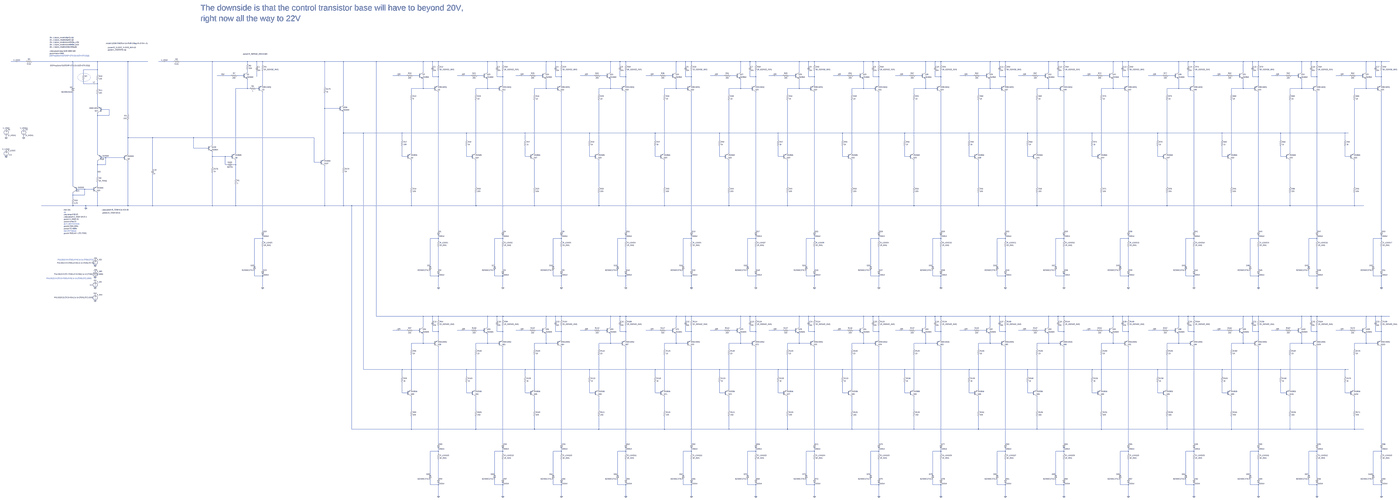
[diagram p0: schematic current_source_with_switch2.asc, whole sheet]
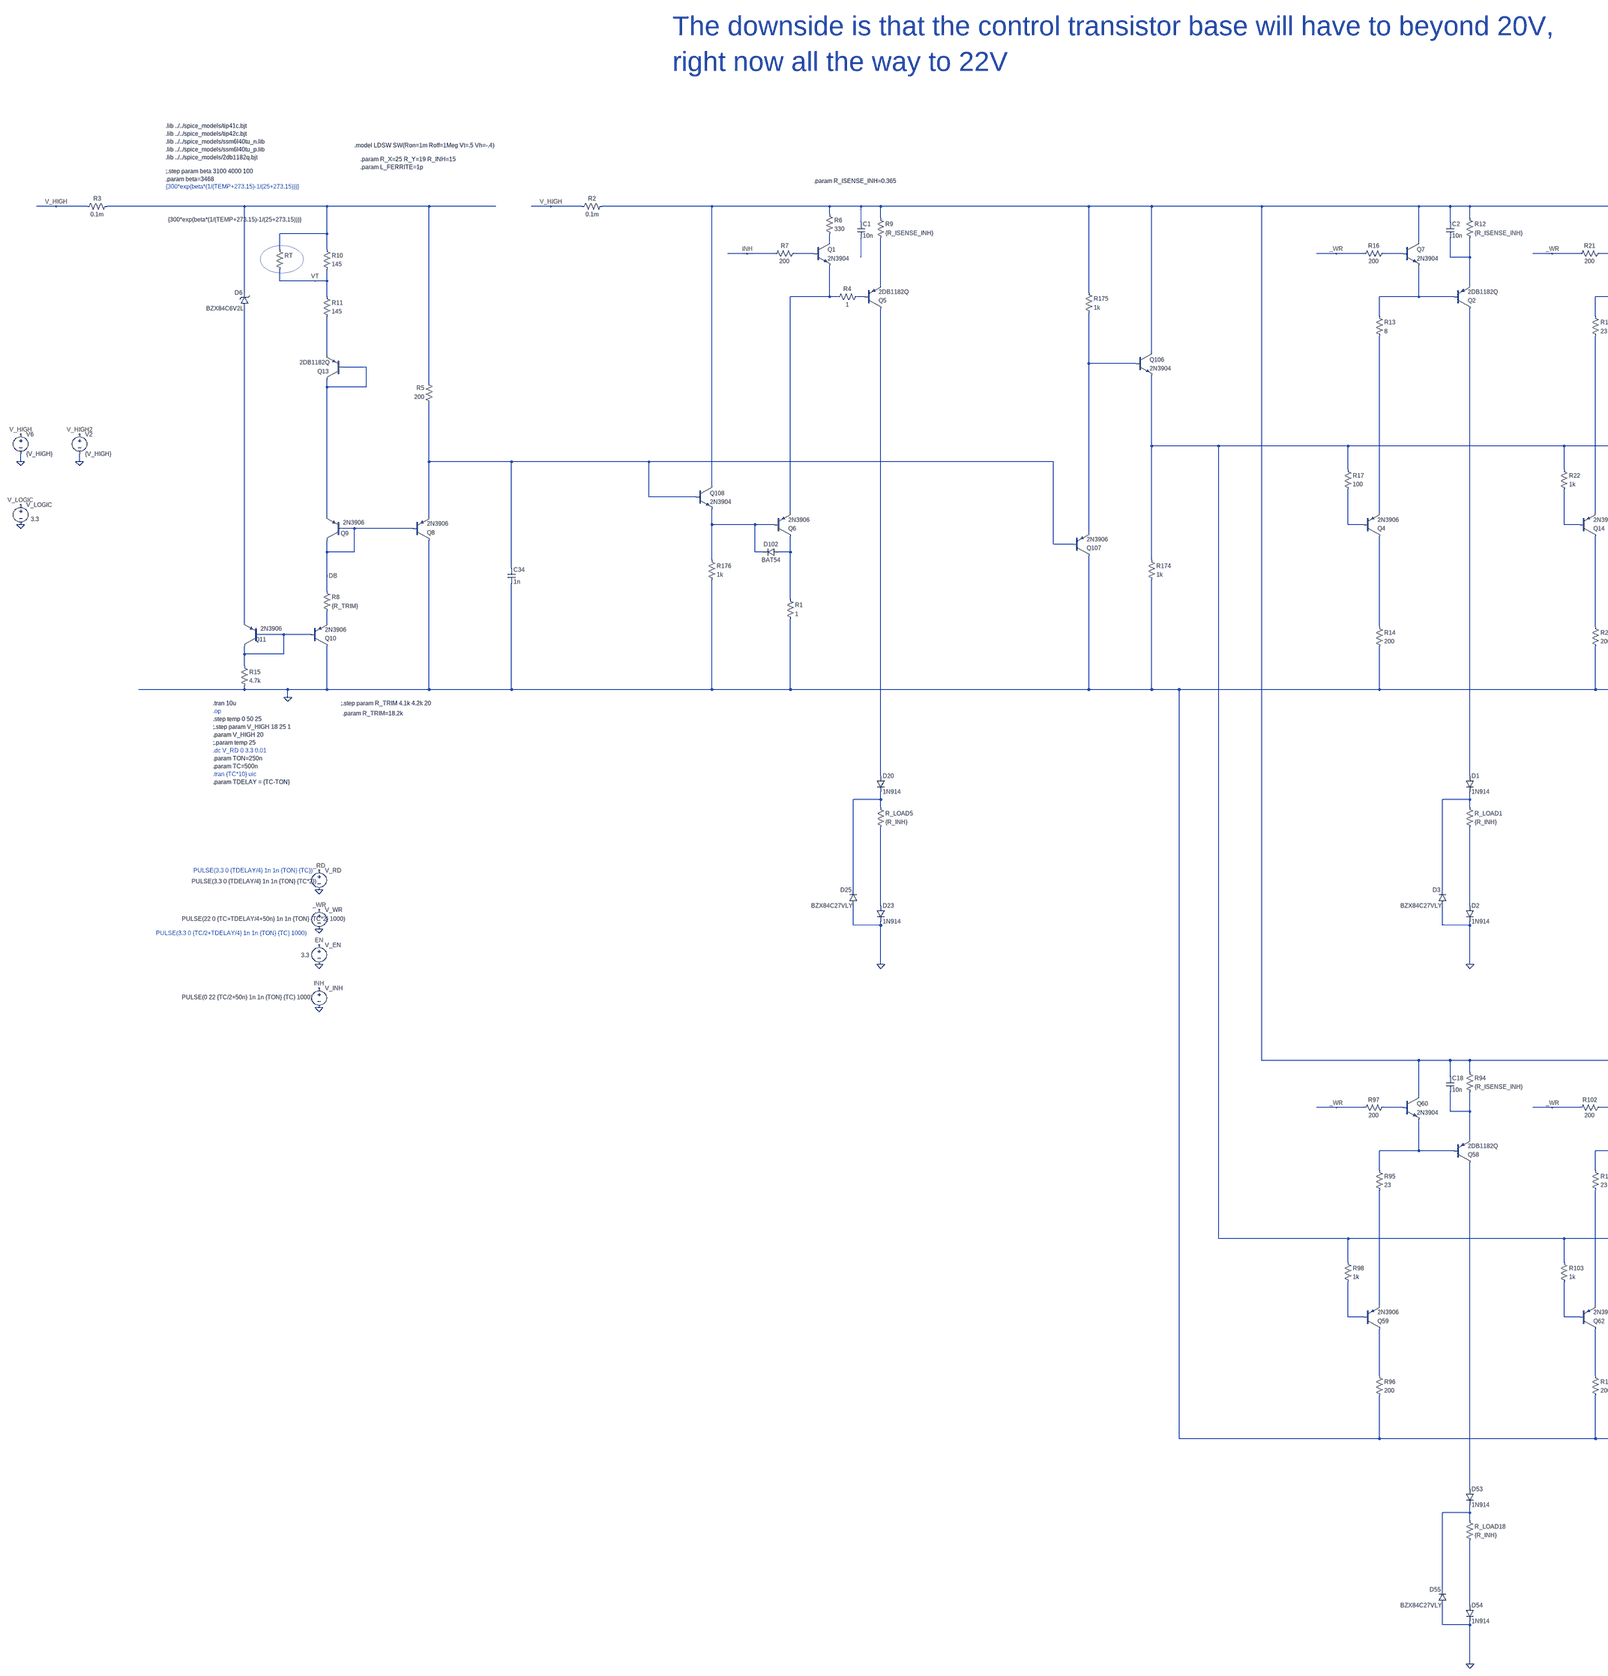
[diagram p1: schematic current_source_with_switch2.asc, part, row 1 of 1, column 1 of 3]
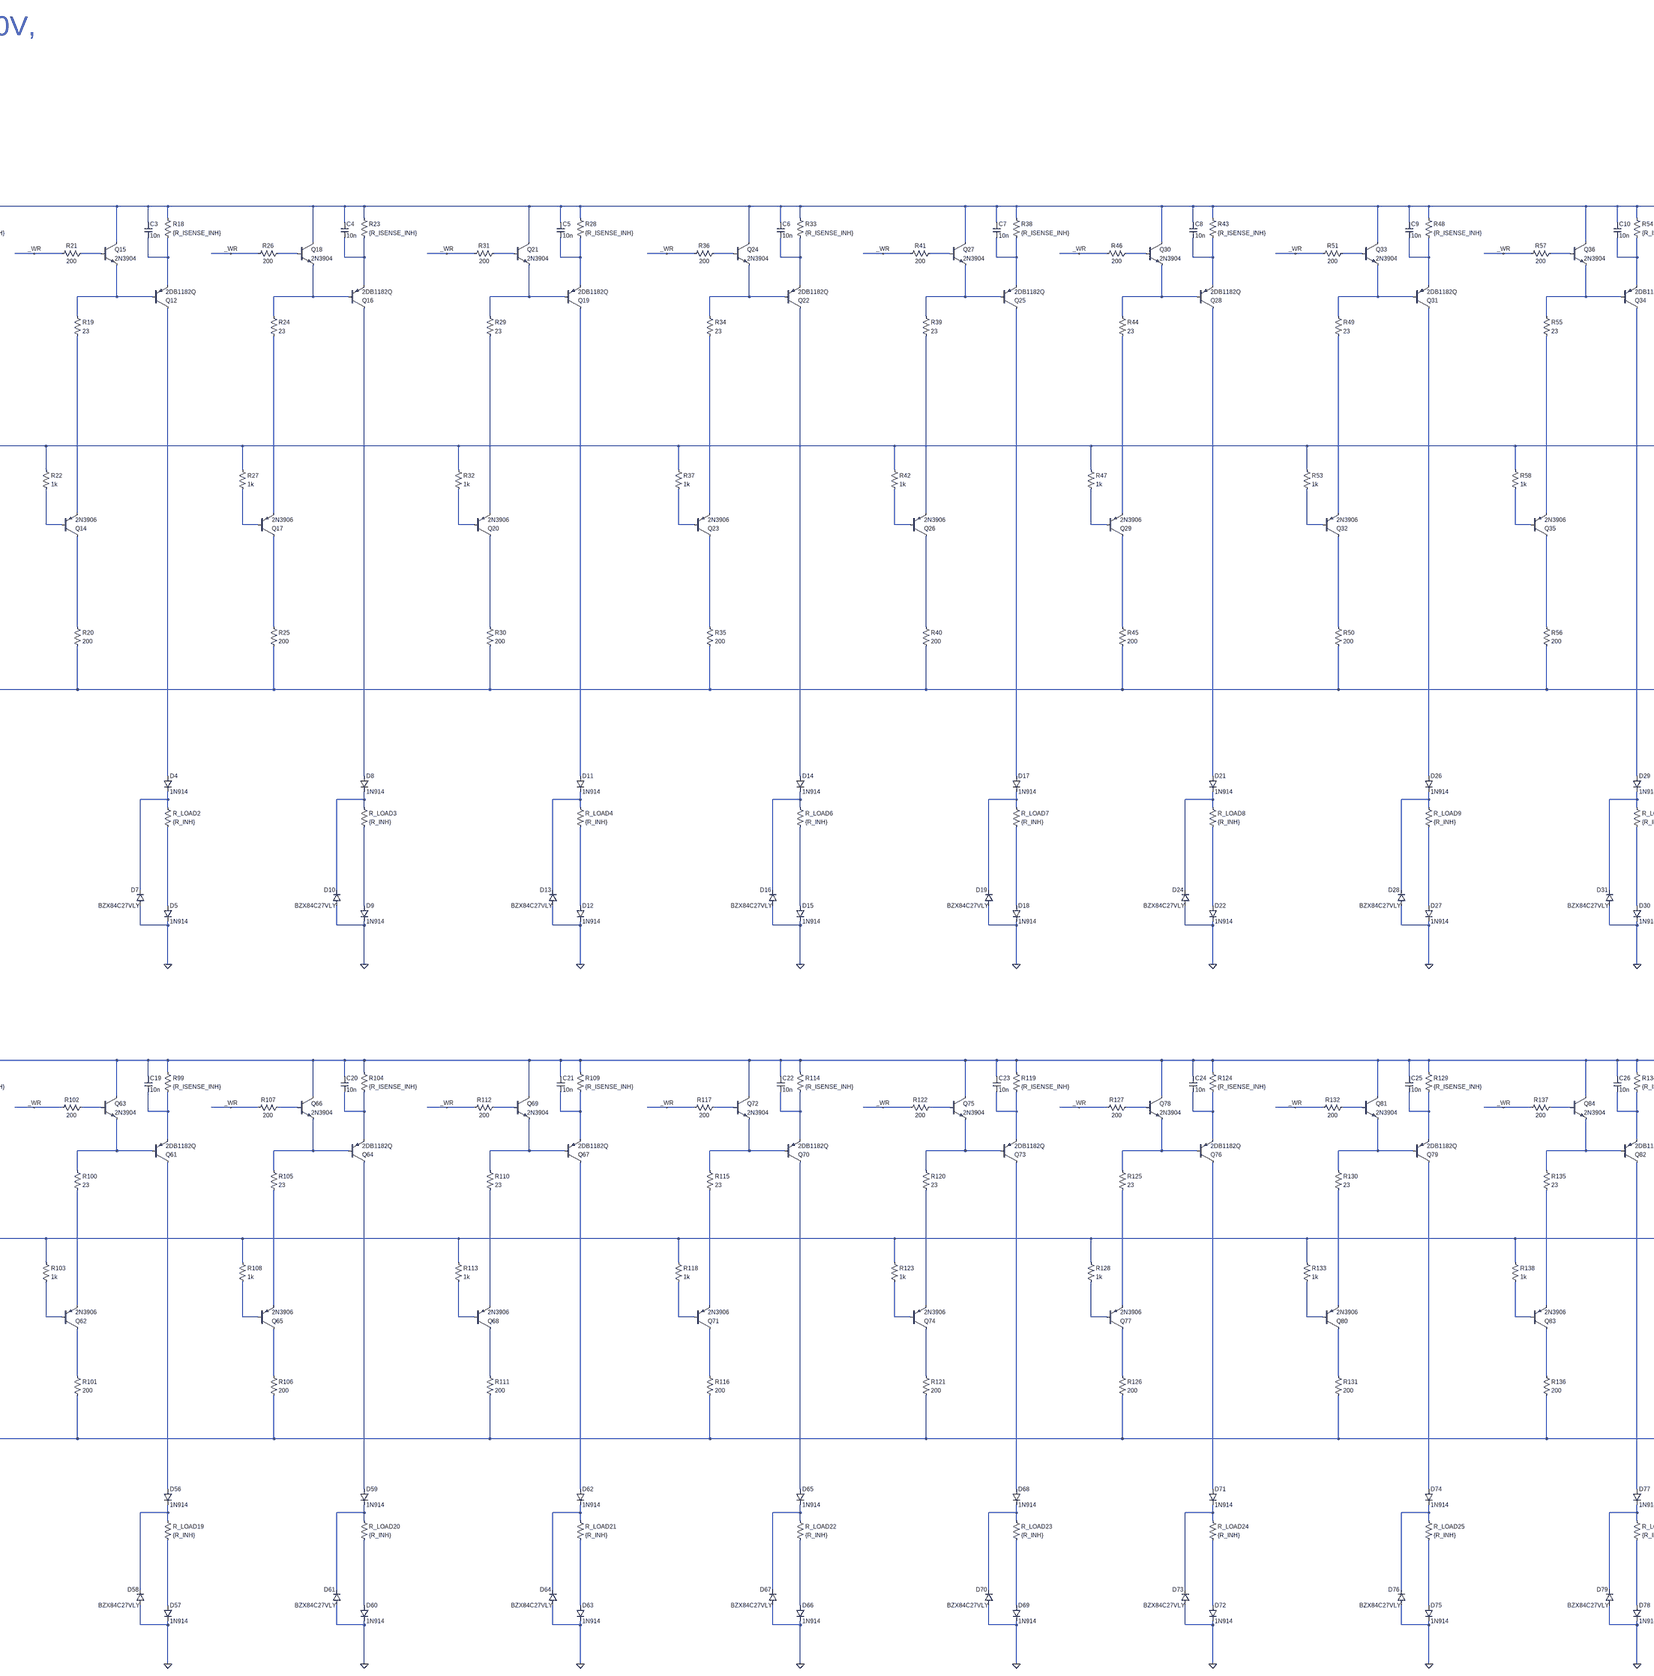
[diagram p2: schematic current_source_with_switch2.asc, part, row 1 of 1, column 2 of 3]
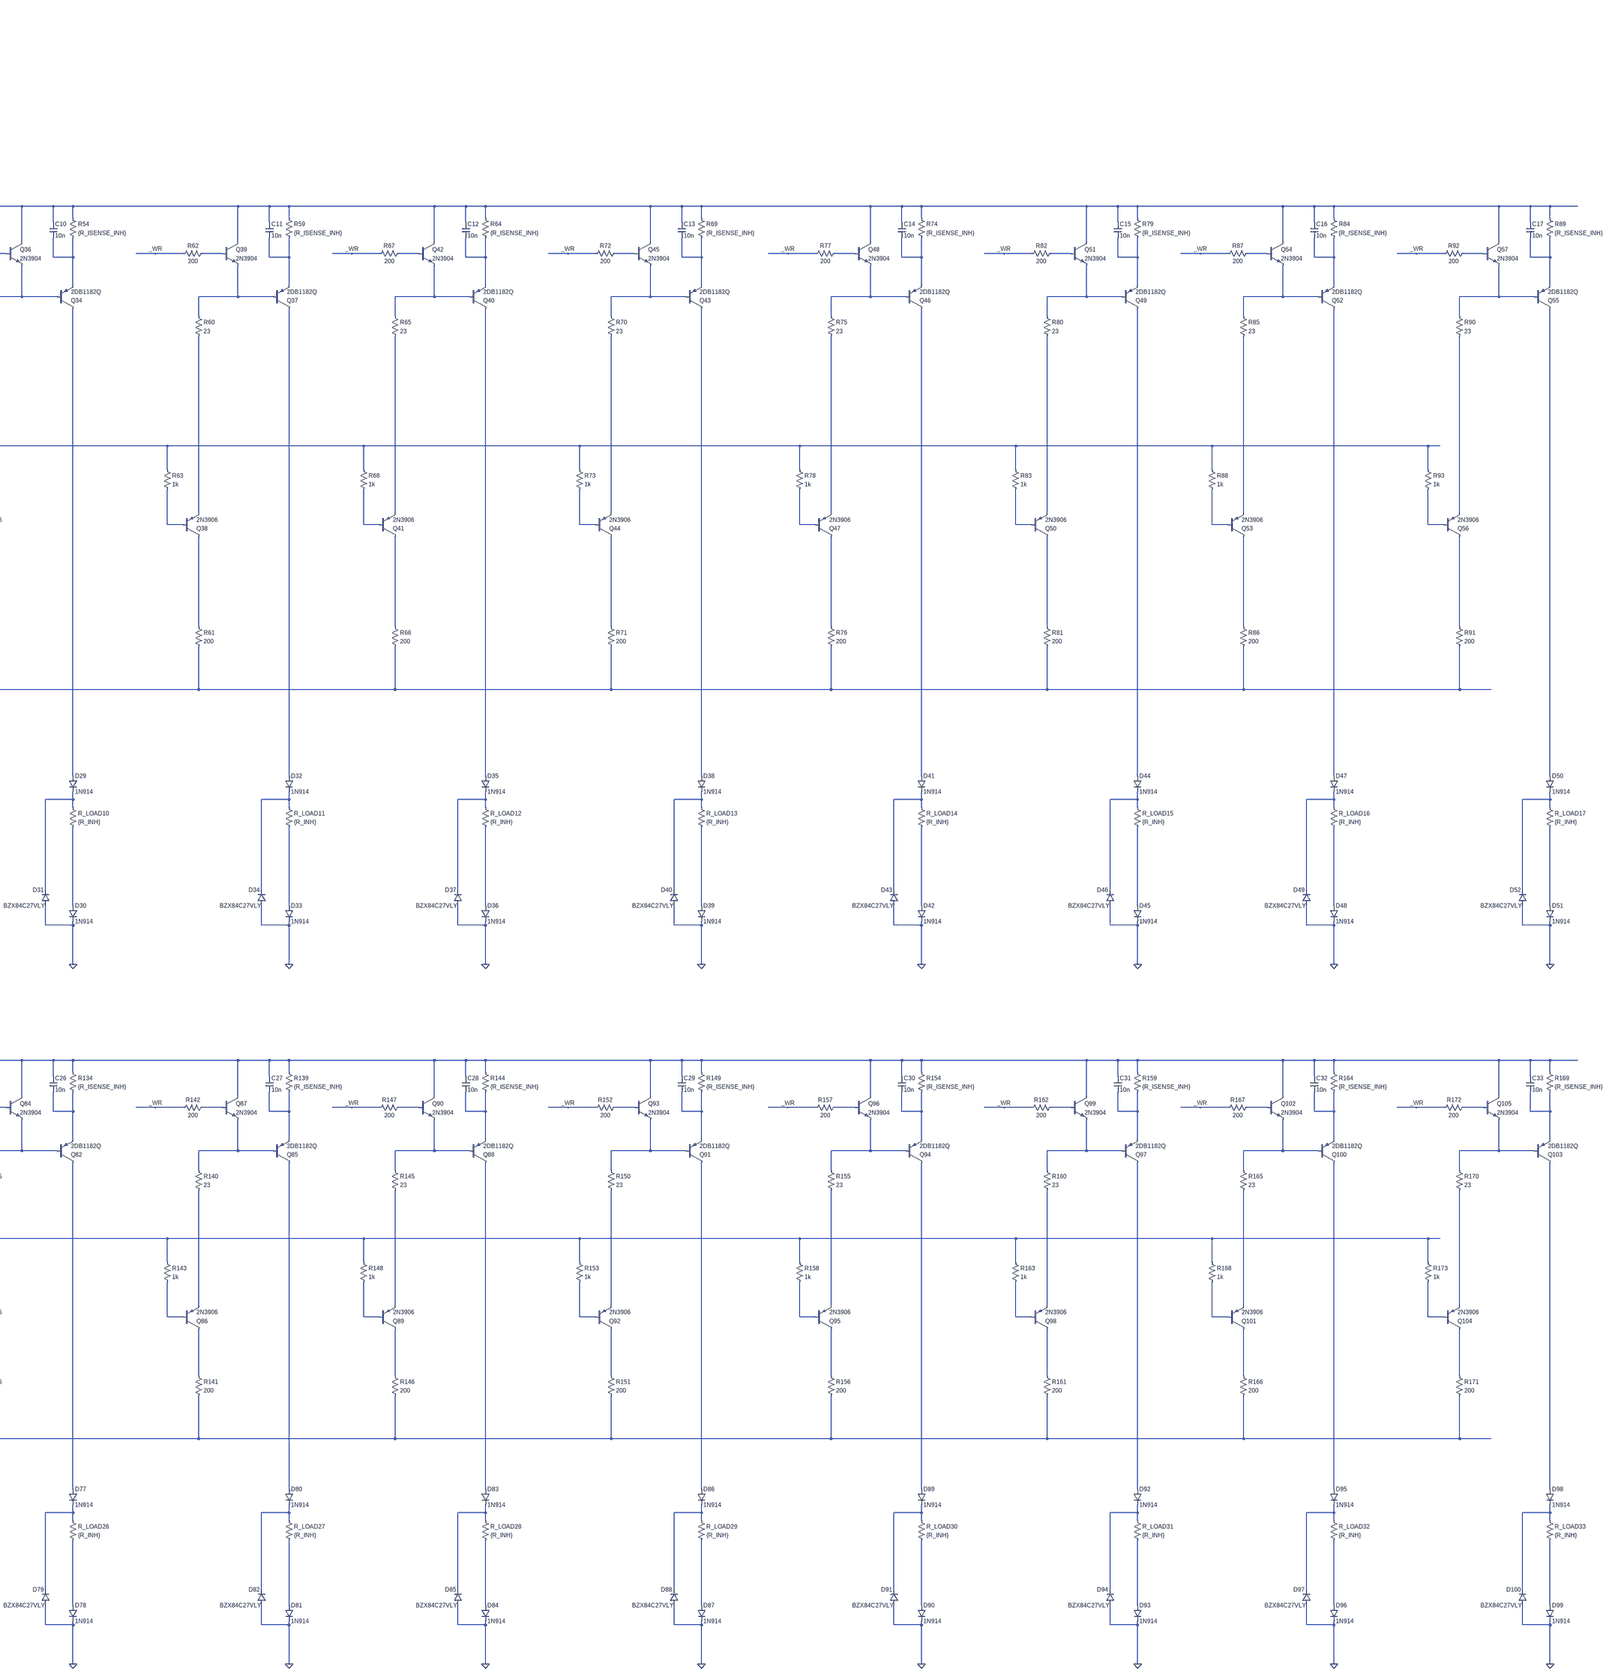
[diagram p3: schematic current_source_with_switch2.asc, part, row 1 of 1, column 3 of 3]
* current_source_with_switch2.asc
R8 DB N097 {R_TRIM}
R9 N002 N038 {R_ISENSE_INH}
Q5 N115 N040 N038 0 2DB1182Q
Q8 0 DB N061 0 2N3906
Q9 DB DB N059 0 2N3906
R10 N001 VT 145
R11 VT N057 145
RT N001 VT {300*exp(beta*(1/(TEMP+273.15)-1/(25+273.15)))}
D6 N096 N001 BZX84C6V2L
R15 N114 0 4.7k
Q10 0 N114 N097 0 2N3906
Q11 N114 N114 N096 0 2N3906
Q6 N095 N078 N039 0 2N3906
Q13 N059 N059 N057 0 2DB1182Q
R5 N061 N001 200
R2 V_HIGH N002 0.1m
R3 V_HIGH N001 0.1m
V6 V_HIGH 0 {V_HIGH}
V_RD _RD 0 PULSE(3.3 0 {TDELAY/4} 1n 1n {TON} {TC*2})
V_EN EN 0 3.3
V_LOGIC V_LOGIC 0 3.3
R_LOAD5 N132 N149 {R_INH}
V_INH INH 0 PULSE(0 22 {TC/2+50n} 1n 1n {TON} {TC} 1000)
D20 N115 N132 1N914
D23 N149 0 1N914
D25 0 N132 BZX84C27VLY
V2 V_HIGH2 0 {V_HIGH}
V_WR _WR 0 PULSE(22 0 {TC+TDELAY/4+50n} 1n 1n {TON} {TC*2} 1000)
Q1 N003 N004 N039 0 2N3904
R7 N004 INH 200
R12 N002 N022 {R_ISENSE_INH}
Q2 N116 N041 N022 0 2DB1182Q
Q4 N098 N079 N062 0 2N3906
R_LOAD1 N133 N150 {R_INH}
D1 N116 N133 1N914
D2 N150 0 1N914
D3 0 N133 BZX84C27VLY
R13 N041 N062 8
Q7 N002 N005 N041 0 2N3904
R14 N098 0 200
R16 N005 _WR 200
C1 N002 N021 10n
C2 N002 N022 10n
R17 N060 N079 100
R18 N002 N023 {R_ISENSE_INH}
Q12 N117 N042 N023 0 2DB1182Q
Q14 N099 N080 N063 0 2N3906
R_LOAD2 N134 N151 {R_INH}
D4 N117 N134 1N914
D5 N151 0 1N914
D7 0 N134 BZX84C27VLY
R19 N042 N063 23
Q15 N002 N006 N042 0 2N3904
R20 N099 0 200
R21 N006 _WR 200
C3 N002 N023 10n
R22 N060 N080 1k
R23 N002 N024 {R_ISENSE_INH}
Q16 N118 N043 N024 0 2DB1182Q
Q17 N100 N081 N064 0 2N3906
R_LOAD3 N135 N152 {R_INH}
D8 N118 N135 1N914
D9 N152 0 1N914
D10 0 N135 BZX84C27VLY
R24 N043 N064 23
Q18 N002 N007 N043 0 2N3904
R25 N100 0 200
R26 N007 _WR 200
C4 N002 N024 10n
R27 N060 N081 1k
R28 N002 N025 {R_ISENSE_INH}
Q19 N119 N044 N025 0 2DB1182Q
Q20 N101 N082 N065 0 2N3906
R_LOAD4 N136 N153 {R_INH}
D11 N119 N136 1N914
D12 N153 0 1N914
D13 0 N136 BZX84C27VLY
R29 N044 N065 23
Q21 N002 N008 N044 0 2N3904
R30 N101 0 200
R31 N008 _WR 200
C5 N002 N025 10n
R32 N060 N082 1k
R33 N002 N026 {R_ISENSE_INH}
Q22 N120 N045 N026 0 2DB1182Q
Q23 N102 N083 N066 0 2N3906
R_LOAD6 N137 N154 {R_INH}
D14 N120 N137 1N914
D15 N154 0 1N914
D16 0 N137 BZX84C27VLY
R34 N045 N066 23
Q24 N002 N009 N045 0 2N3904
R35 N102 0 200
R36 N009 _WR 200
C6 N002 N026 10n
R37 N060 N083 1k
R38 N002 N027 {R_ISENSE_INH}
Q25 N121 N046 N027 0 2DB1182Q
Q26 N103 N084 N067 0 2N3906
R_LOAD7 N138 N155 {R_INH}
D17 N121 N138 1N914
D18 N155 0 1N914
D19 0 N138 BZX84C27VLY
R39 N046 N067 23
Q27 N002 N010 N046 0 2N3904
R40 N103 0 200
R41 N010 _WR 200
C7 N002 N027 10n
R42 N060 N084 1k
R43 N002 N028 {R_ISENSE_INH}
Q28 N122 N047 N028 0 2DB1182Q
Q29 N104 N085 N068 0 2N3906
R_LOAD8 N139 N156 {R_INH}
D21 N122 N139 1N914
D22 N156 0 1N914
D24 0 N139 BZX84C27VLY
R44 N047 N068 23
Q30 N002 N011 N047 0 2N3904
R45 N104 0 200
R46 N011 _WR 200
C8 N002 N028 10n
R47 N060 N085 1k
R48 N002 N029 {R_ISENSE_INH}
Q31 N123 N048 N029 0 2DB1182Q
Q32 N105 N086 N069 0 2N3906
R_LOAD9 N140 N157 {R_INH}
D26 N123 N140 1N914
D27 N157 0 1N914
D28 0 N140 BZX84C27VLY
R49 N048 N069 23
Q33 N002 N012 N048 0 2N3904
R50 N105 0 200
R51 N012 _WR 200
C9 N002 N029 10n
R53 N060 N086 1k
R54 N002 N030 {R_ISENSE_INH}
Q34 N124 N049 N030 0 2DB1182Q
Q35 N106 N087 N070 0 2N3906
R_LOAD10 N141 N158 {R_INH}
D29 N124 N141 1N914
D30 N158 0 1N914
D31 0 N141 BZX84C27VLY
R55 N049 N070 23
Q36 N002 N013 N049 0 2N3904
R56 N106 0 200
R57 N013 _WR 200
C10 N002 N030 10n
R58 N060 N087 1k
R59 N002 N031 {R_ISENSE_INH}
Q37 N125 N050 N031 0 2DB1182Q
Q38 N107 N088 N071 0 2N3906
R_LOAD11 N142 N159 {R_INH}
D32 N125 N142 1N914
D33 N159 0 1N914
D34 0 N142 BZX84C27VLY
R60 N050 N071 23
Q39 N002 N014 N050 0 2N3904
R61 N107 0 200
R62 N014 _WR 200
C11 N002 N031 10n
R63 N060 N088 1k
R64 N002 N032 {R_ISENSE_INH}
Q40 N126 N051 N032 0 2DB1182Q
Q41 N108 N089 N072 0 2N3906
R_LOAD12 N143 N160 {R_INH}
D35 N126 N143 1N914
D36 N160 0 1N914
D37 0 N143 BZX84C27VLY
R65 N051 N072 23
Q42 N002 N015 N051 0 2N3904
R66 N108 0 200
R67 N015 _WR 200
C12 N002 N032 10n
R68 N060 N089 1k
R69 N002 N033 {R_ISENSE_INH}
Q43 N127 N052 N033 0 2DB1182Q
Q44 N109 N090 N073 0 2N3906
R_LOAD13 N144 N161 {R_INH}
D38 N127 N144 1N914
D39 N161 0 1N914
D40 0 N144 BZX84C27VLY
R70 N052 N073 23
Q45 N002 N016 N052 0 2N3904
R71 N109 0 200
R72 N016 _WR 200
C13 N002 N033 10n
R73 N060 N090 1k
R74 N002 N034 {R_ISENSE_INH}
Q46 N128 N053 N034 0 2DB1182Q
Q47 N110 N091 N074 0 2N3906
R_LOAD14 N145 N162 {R_INH}
D41 N128 N145 1N914
D42 N162 0 1N914
D43 0 N145 BZX84C27VLY
R75 N053 N074 23
Q48 N002 N017 N053 0 2N3904
R76 N110 0 200
R77 N017 _WR 200
C14 N002 N034 10n
R78 N060 N091 1k
R79 N002 N035 {R_ISENSE_INH}
Q49 N129 N054 N035 0 2DB1182Q
Q50 N111 N092 N075 0 2N3906
R_LOAD15 N146 N163 {R_INH}
D44 N129 N146 1N914
D45 N163 0 1N914
D46 0 N146 BZX84C27VLY
R80 N054 N075 23
Q51 N002 N018 N054 0 2N3904
R81 N111 0 200
R82 N018 _WR 200
C15 N002 N035 10n
R83 N060 N092 1k
R84 N002 N036 {R_ISENSE_INH}
Q52 N130 N055 N036 0 2DB1182Q
Q53 N112 N093 N076 0 2N3906
R_LOAD16 N147 N164 {R_INH}
D47 N130 N147 1N914
D48 N164 0 1N914
D49 0 N147 BZX84C27VLY
R85 N055 N076 23
Q54 N002 N019 N055 0 2N3904
R86 N112 0 200
R87 N019 _WR 200
C16 N002 N036 10n
R88 N060 N093 1k
R89 N002 N037 {R_ISENSE_INH}
Q55 N131 N056 N037 0 2DB1182Q
Q56 N113 N094 N077 0 2N3906
R_LOAD17 N148 N165 {R_INH}
D50 N131 N148 1N914
D51 N165 0 1N914
D52 0 N148 BZX84C27VLY
R90 N056 N077 23
Q57 N002 N020 N056 0 2N3904
R91 N113 0 200
R92 N020 _WR 200
C17 N002 N037 10n
R93 N060 N094 1k
R94 N002 N182 {R_ISENSE_INH}
Q58 N262 N198 N182 0 2DB1182Q
Q59 N246 N230 N214 0 2N3906
R_LOAD18 N278 N294 {R_INH}
D53 N262 N278 1N914
D54 N294 0 1N914
D55 0 N278 BZX84C27VLY
R95 N198 N214 23
Q60 N002 N166 N198 0 2N3904
R96 N246 0 200
R97 N166 _WR 200
C18 N002 N182 10n
R98 N060 N230 1k
R99 N002 N183 {R_ISENSE_INH}
Q61 N263 N199 N183 0 2DB1182Q
Q62 N247 N231 N215 0 2N3906
R_LOAD19 N279 N295 {R_INH}
D56 N263 N279 1N914
D57 N295 0 1N914
D58 0 N279 BZX84C27VLY
R100 N199 N215 23
Q63 N002 N167 N199 0 2N3904
R101 N247 0 200
R102 N167 _WR 200
C19 N002 N183 10n
R103 N060 N231 1k
R104 N002 N184 {R_ISENSE_INH}
Q64 N264 N200 N184 0 2DB1182Q
Q65 N248 N232 N216 0 2N3906
R_LOAD20 N280 N296 {R_INH}
D59 N264 N280 1N914
D60 N296 0 1N914
D61 0 N280 BZX84C27VLY
R105 N200 N216 23
Q66 N002 N168 N200 0 2N3904
R106 N248 0 200
R107 N168 _WR 200
C20 N002 N184 10n
R108 N060 N232 1k
R109 N002 N185 {R_ISENSE_INH}
Q67 N265 N201 N185 0 2DB1182Q
Q68 N249 N233 N217 0 2N3906
R_LOAD21 N281 N297 {R_INH}
D62 N265 N281 1N914
D63 N297 0 1N914
D64 0 N281 BZX84C27VLY
R110 N201 N217 23
Q69 N002 N169 N201 0 2N3904
R111 N249 0 200
R112 N169 _WR 200
C21 N002 N185 10n
R113 N060 N233 1k
R114 N002 N186 {R_ISENSE_INH}
Q70 N266 N202 N186 0 2DB1182Q
Q71 N250 N234 N218 0 2N3906
R_LOAD22 N282 N298 {R_INH}
D65 N266 N282 1N914
D66 N298 0 1N914
D67 0 N282 BZX84C27VLY
R115 N202 N218 23
Q72 N002 N170 N202 0 2N3904
R116 N250 0 200
R117 N170 _WR 200
C22 N002 N186 10n
R118 N060 N234 1k
R119 N002 N187 {R_ISENSE_INH}
Q73 N267 N203 N187 0 2DB1182Q
Q74 N251 N235 N219 0 2N3906
R_LOAD23 N283 N299 {R_INH}
D68 N267 N283 1N914
D69 N299 0 1N914
D70 0 N283 BZX84C27VLY
R120 N203 N219 23
Q75 N002 N171 N203 0 2N3904
R121 N251 0 200
R122 N171 _WR 200
C23 N002 N187 10n
R123 N060 N235 1k
R124 N002 N188 {R_ISENSE_INH}
Q76 N268 N204 N188 0 2DB1182Q
Q77 N252 N236 N220 0 2N3906
R_LOAD24 N284 N300 {R_INH}
D71 N268 N284 1N914
D72 N300 0 1N914
D73 0 N284 BZX84C27VLY
R125 N204 N220 23
Q78 N002 N172 N204 0 2N3904
R126 N252 0 200
R127 N172 _WR 200
C24 N002 N188 10n
R128 N060 N236 1k
R129 N002 N189 {R_ISENSE_INH}
Q79 N269 N205 N189 0 2DB1182Q
Q80 N253 N237 N221 0 2N3906
R_LOAD25 N285 N301 {R_INH}
D74 N269 N285 1N914
D75 N301 0 1N914
D76 0 N285 BZX84C27VLY
R130 N205 N221 23
Q81 N002 N173 N205 0 2N3904
R131 N253 0 200
R132 N173 _WR 200
C25 N002 N189 10n
R133 N060 N237 1k
R134 N002 N190 {R_ISENSE_INH}
Q82 N270 N206 N190 0 2DB1182Q
Q83 N254 N238 N222 0 2N3906
R_LOAD26 N286 N302 {R_INH}
D77 N270 N286 1N914
D78 N302 0 1N914
D79 0 N286 BZX84C27VLY
R135 N206 N222 23
Q84 N002 N174 N206 0 2N3904
R136 N254 0 200
R137 N174 _WR 200
C26 N002 N190 10n
R138 N060 N238 1k
R139 N002 N191 {R_ISENSE_INH}
Q85 N271 N207 N191 0 2DB1182Q
Q86 N255 N239 N223 0 2N3906
R_LOAD27 N287 N303 {R_INH}
D80 N271 N287 1N914
D81 N303 0 1N914
D82 0 N287 BZX84C27VLY
R140 N207 N223 23
Q87 N002 N175 N207 0 2N3904
R141 N255 0 200
R142 N175 _WR 200
C27 N002 N191 10n
R143 N060 N239 1k
R144 N002 N192 {R_ISENSE_INH}
Q88 N272 N208 N192 0 2DB1182Q
Q89 N256 N240 N224 0 2N3906
R_LOAD28 N288 N304 {R_INH}
D83 N272 N288 1N914
D84 N304 0 1N914
D85 0 N288 BZX84C27VLY
R145 N208 N224 23
Q90 N002 N176 N208 0 2N3904
R146 N256 0 200
R147 N176 _WR 200
C28 N002 N192 10n
R148 N060 N240 1k
R149 N002 N193 {R_ISENSE_INH}
Q91 N273 N209 N193 0 2DB1182Q
Q92 N257 N241 N225 0 2N3906
R_LOAD29 N289 N305 {R_INH}
D86 N273 N289 1N914
D87 N305 0 1N914
D88 0 N289 BZX84C27VLY
R150 N209 N225 23
Q93 N002 N177 N209 0 2N3904
R151 N257 0 200
R152 N177 _WR 200
C29 N002 N193 10n
R153 N060 N241 1k
R154 N002 N194 {R_ISENSE_INH}
Q94 N274 N210 N194 0 2DB1182Q
Q95 N258 N242 N226 0 2N3906
R_LOAD30 N290 N306 {R_INH}
D89 N274 N290 1N914
D90 N306 0 1N914
D91 0 N290 BZX84C27VLY
R155 N210 N226 23
Q96 N002 N178 N210 0 2N3904
R156 N258 0 200
R157 N178 _WR 200
C30 N002 N194 10n
R158 N060 N242 1k
R159 N002 N195 {R_ISENSE_INH}
Q97 N275 N211 N195 0 2DB1182Q
Q98 N259 N243 N227 0 2N3906
R_LOAD31 N291 N307 {R_INH}
D92 N275 N291 1N914
D93 N307 0 1N914
D94 0 N291 BZX84C27VLY
R160 N211 N227 23
Q99 N002 N179 N211 0 2N3904
R161 N259 0 200
R162 N179 _WR 200
C31 N002 N195 10n
R163 N060 N243 1k
R164 N002 N196 {R_ISENSE_INH}
Q100 N276 N212 N196 0 2DB1182Q
Q101 N260 N244 N228 0 2N3906
R_LOAD32 N292 N308 {R_INH}
D95 N276 N292 1N914
D96 N308 0 1N914
D97 0 N292 BZX84C27VLY
R165 N212 N228 23
Q102 N002 N180 N212 0 2N3904
R166 N260 0 200
R167 N180 _WR 200
C32 N002 N196 10n
R168 N060 N244 1k
R169 N002 N197 {R_ISENSE_INH}
Q103 N277 N213 N197 0 2DB1182Q
Q104 N261 N245 N229 0 2N3906
R_LOAD33 N293 N309 {R_INH}
D98 N277 N293 1N914
D99 N309 0 1N914
D100 0 N293 BZX84C27VLY
R170 N213 N229 23
Q105 N002 N181 N213 0 2N3904
R171 N261 0 200
R172 N181 _WR 200
C33 N002 N197 10n
R173 N060 N245 1k
Q106 N002 N058 N060 0 2N3904
Q107 0 N061 N058 0 2N3906
R174 N060 0 1k
R175 N002 N058 1k
Q108 N002 N061 N078 0 2N3904
R176 N078 0 1k
C34 N061 0 1n
R1 N095 0 1
R4 N040 N039 1
D102 N095 N078 BAT54
R6 N002 N003 330
.model D D
.lib standard.dio
.model NPN NPN
.model PNP PNP
.lib standard.bjt
.lib ../../spice_models/tip42c.bjt
.lib ../../spice_models/tip41c.bjt
.step temp 0 50 25
* .op
;.step param V_HIGH 18 25 1
.param beta=3468
;.step param beta 3100 4000 100
* {300*exp(beta*(1/(TEMP+273.15)-1/(25+273.15)))}
.param L_FERRITE=1p
.param R_X=25 R_Y=19 R_INH=15
.param R_ISENSE_INH=0.365
;.step param R_TRIM 4.1k 4.2k 20
.param R_TRIM=18.2k
.param V_HIGH 20
;.param temp 25
.model LDSW SW(Ron=1m Roff=1Meg Vt=.5 Vh=-.4)
.tran 10u
* .tran {TC*10} uic
.param TON=250n
.param TC=500n
* .dc V_RD 0 3.3 0.01
* PULSE(3.3 0 {TDELAY/4} 1n 1n {TON} {TC})
.lib ../../spice_models/ssm6l40tu_n.lib
.lib ../../spice_models/ssm6l40tu_p.lib
.param TDELAY = {TC-TON}
.lib ../../spice_models/2db1182q.bjt
* PULSE(3.3 0 {TC/2+TDELAY/4} 1n 1n {TON} {TC} 1000)
* The downside is that the control transistor base will have to beyond 20V,
* right now all the way to 22V
.backanno
.end